# EAGLE schematic dlp.vco.dualosc.v1.1 (EAGLE 7.2.0)
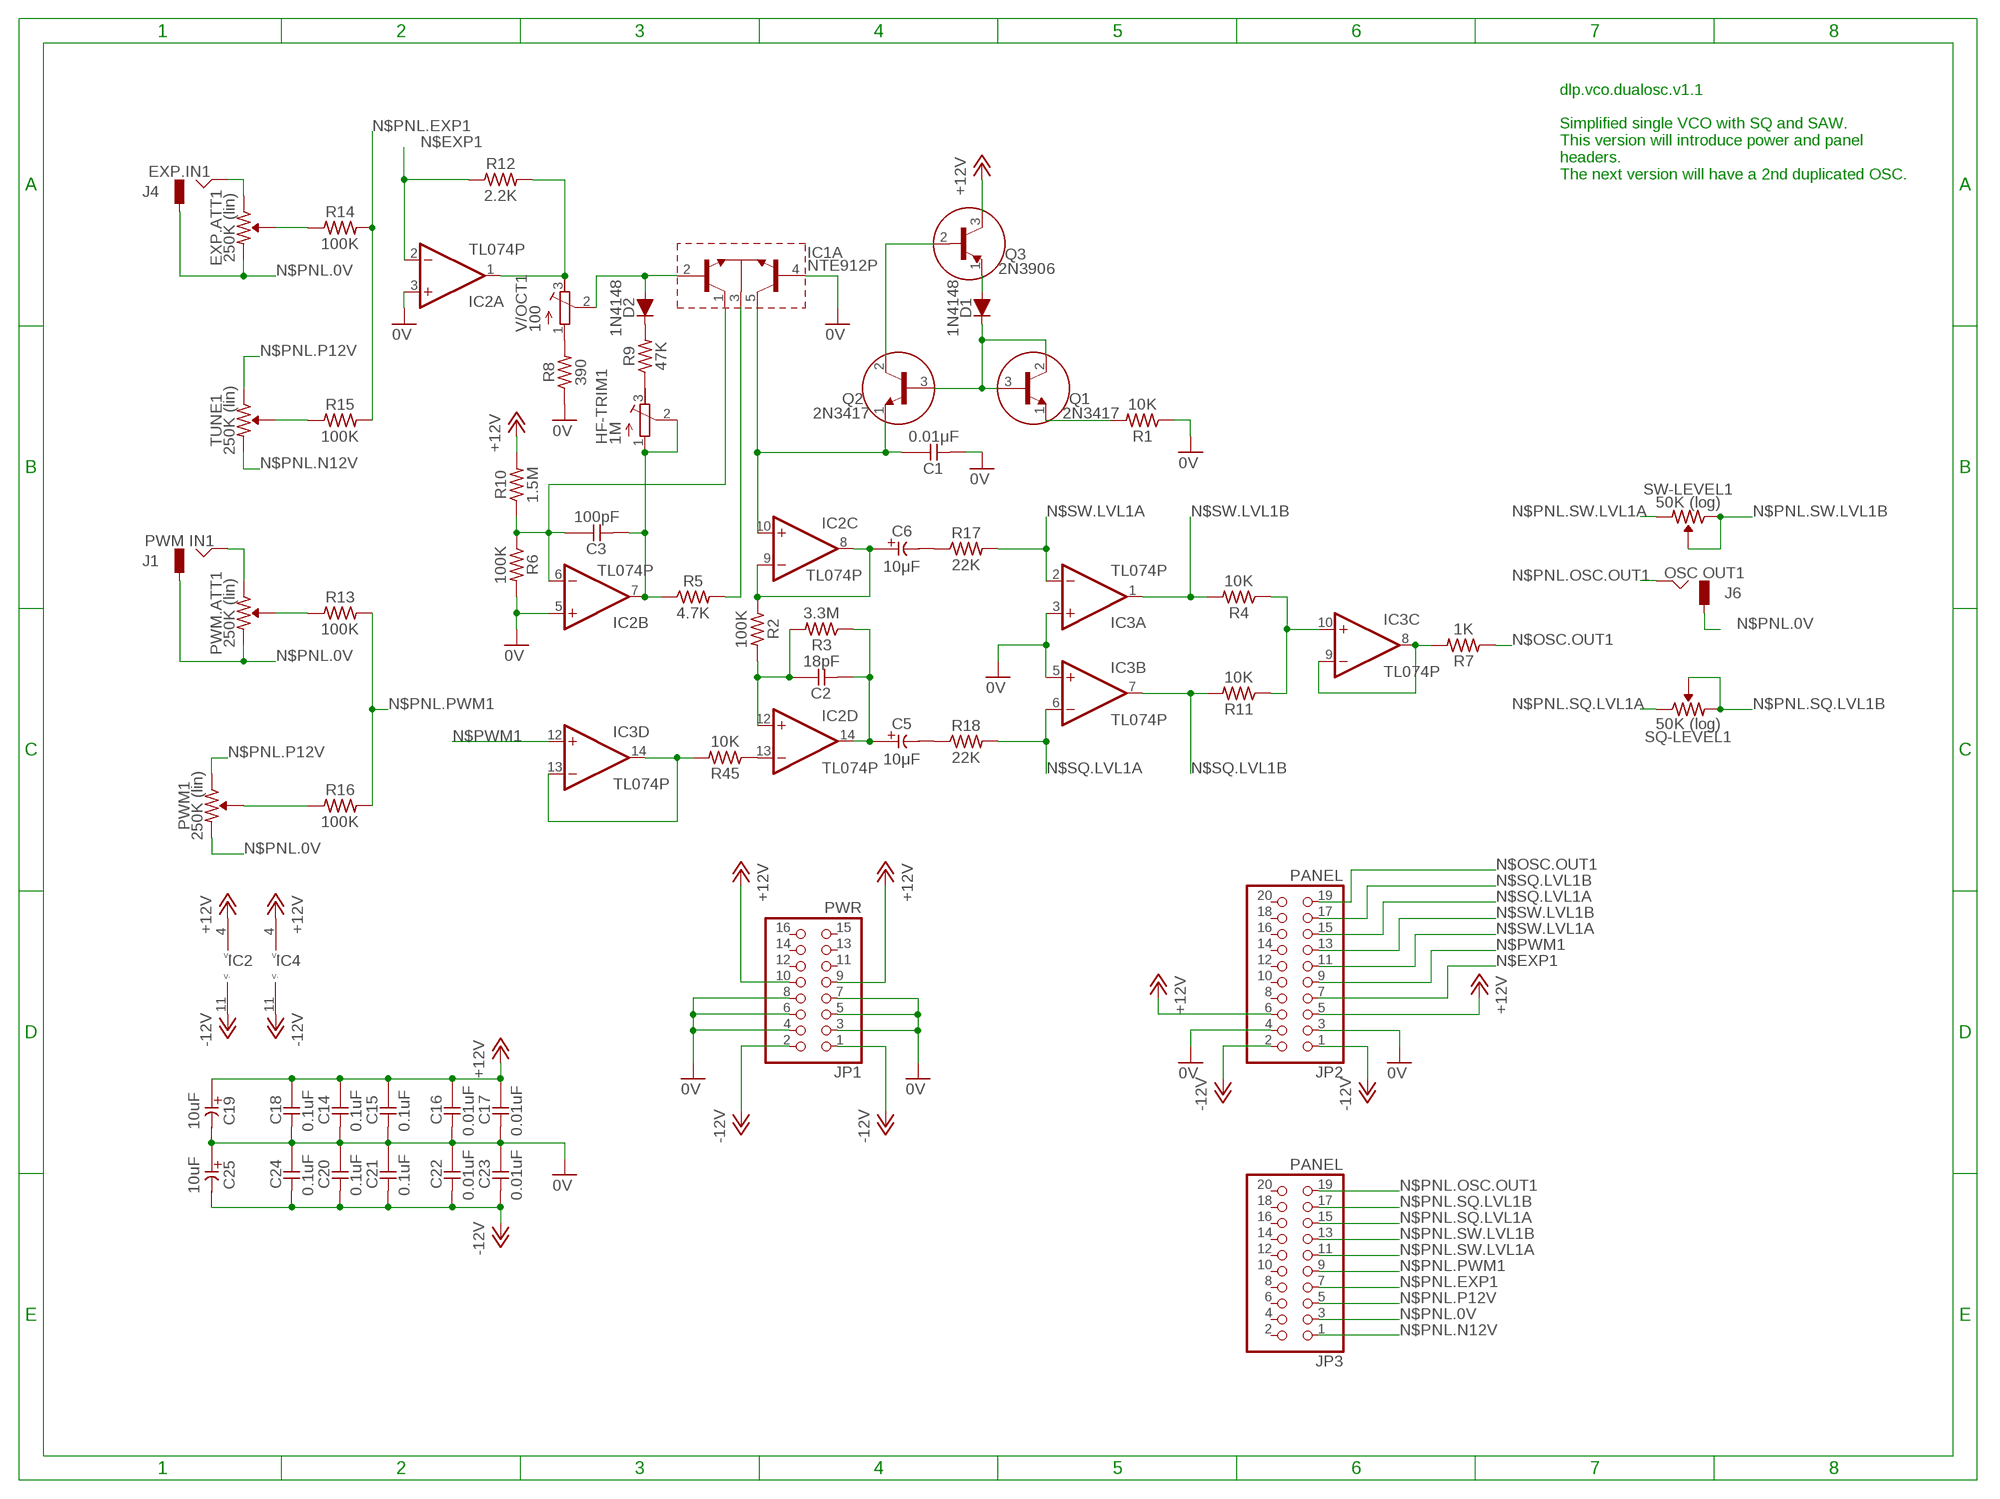
[diagram p0: schematic, sheet 1]

## Parts
C1  0.01μF  CC-US025-024X044  [C025-024X044]
C2  18pF  CC-US025-024X044  [C025-024X044]
C3  100pF  CC-US025-024X044  [C025-024X044]
C5  10μF  CE-USE2-5  [E2-5]
C6  10μF  CE-USE2-5  [E2-5]
C14  0.1uF  CC-US025-024X044  [C025-024X044]
C15  0.1uF  CC-US025-024X044  [C025-024X044]
C16  0.01uF  CC-US025-024X044  [C025-024X044]
C17  0.01uF  CC-US025-024X044  [C025-024X044]
C18  0.1uF  CC-US025-024X044  [C025-024X044]
C19  10uF  CE-USE2-5  [E2-5]
C20  0.1uF  CC-US025-024X044  [C025-024X044]
C21  0.1uF  CC-US025-024X044  [C025-024X044]
C22  0.01uF  CC-US025-024X044  [C025-024X044]
C23  0.01uF  CC-US025-024X044  [C025-024X044]
C24  0.1uF  CC-US025-024X044  [C025-024X044]
C25  10uF  CE-USE2-5  [E2-5]
D1  1N4148  [DO35-7]
D2  1N4148  [DO35-7]
EXP.ATT1  250K (lin)  R-VAR  [R-VAR]
HF-TRIM1  1M  R-TRIMM3296Y  [RTRIM3296Y]
IC1  NTE912P  [DIL14]
IC2  TL074P  [DIL14]
IC3  TL074P  [DIL14]
J1  PWM IN1  JACK-M  [JACK-M]
J4  EXP.IN1  JACK-M  [JACK-M]
J6  OSC OUT1  JACK-M  [JACK-M]
JP1  PWR  PINHD-2X8  [2X08]
JP2  PANEL  PINHD-2X10  [2X10]
JP3  PANEL  PINHD-2X10  [2X10]
PWM1  250K (lin)  R-VAR  [R-VAR]
PWM.ATT1  250K (lin)  R-VAR  [R-VAR]
Q1  2N3417  [TO92]
Q2  2N3417  [TO92]
Q3  2N3906  [TO92]
R1  10K  R0309/10  [0309/10]
R2  100K  R0309/10  [0309/10]
R3  3.3M  R0309/10  [0309/10]
R4  10K  R0309/10  [0309/10]
R5  4.7K  R0309/10  [0309/10]
R6  100K  R0309/10  [0309/10]
R7  1K  R0309/10  [0309/10]
R8  390  R0309/10  [0309/10]
R9  47K  R0309/10  [0309/10]
R10  1.5M  R0309/10  [0309/10]
R11  10K  R0309/10  [0309/10]
R12  2.2K  R0309/10  [0309/10]
R13  100K  R0309/10  [0309/10]
R14  100K  R0309/10  [0309/10]
R15  100K  R0309/10  [0309/10]
R16  100K  R0309/10  [0309/10]
R17  22K  R0309/10  [0309/10]
R18  22K  R0309/10  [0309/10]
R45  10K  R0309/10  [0309/10]
SQ-LEVEL1  50K (log)  R-VAR  [R-VAR]
SW-LEVEL1  50K (log)  R-VAR  [R-VAR]
TUNE1  250K (lin)  R-VAR  [R-VAR]
V/OCT1  100  R-TRIMM3296Y  [RTRIM3296Y]

## Nets
0V: C1.2 C14.2 C15.2 C16.2 C17.2 C18.2 C19.- C20.1 C21.1 C22.1 C23.1 C24.1 C25.+ IC1.4(A:B3) IC2.3(A:+IN) IC2.5(B:+IN) IC3.3(A:+IN) IC3.5(B:+IN) JP1.3 JP1.4 JP1.5 JP1.6 JP1.7 JP1.8 JP2.3 JP2.4 R1.1 R6.2 R8.1
+12V: C14.1 C15.1 C16.1 C17.1 C18.1 C19.+ IC2.4(P:V+) IC3.4(P:V+) JP1.9 JP1.10 JP2.5 JP2.6 Q3.3(C) R10.2
-12V: C20.2 C21.2 C22.2 C23.2 C24.2 C25.- IC2.11(P:V-) IC3.11(P:V-) JP1.1 JP1.2 JP2.1 JP2.2
N$1: C1.1 IC1.5(A:C3) IC2.10(C:+IN) Q2.1(E)
N$2: Q2.2(C) Q3.2(B)
N$3: D1.A Q3.1(E)
N$4: C6.+ IC2.8(C:OUT) IC2.9(C:-IN) R2.1
N$5: D1.C Q1.2(C) Q1.3(B) Q2.3(B)
N$6: Q1.1(E) R1.2
N$7: C2.1 IC2.12(D:+IN) R2.2 R3.2
N$8: IC2.13(D:-IN) R45.1
N$9: C2.2 C5.+ IC2.14(D:OUT) R3.1
N$10: PWM.ATT1.VAR R13.1
N$11: D2.A IC1.2(A:B1) V/OCT1.2(S)
N$12: IC1.3(A:E) R5.2
N$13: D2.C R9.2
N$14: R8.2 V/OCT1.1(A)
N$15: C3.1 IC1.1(A:C1) IC2.6(B:-IN) R6.1 R10.1
N$16: IC2.1(A:OUT) R12.2 V/OCT1.3(E)
N$17: HF-TRIM1.3(E) R9.1
N$18: IC3.10(C:+IN) R4.1 R11.1
N$19: PWM1.VAR R16.1
N$20: IC3.8(C:OUT) IC3.9(C:-IN) R7.2
N$23: EXP.ATT1.VAR R14.1
N$24: R15.1 TUNE1.VAR
N$25: J1.HOT PWM.ATT1.R1
N$26: EXP.ATT1.R1 J4.HOT
N$27: IC3.13(D:-IN) IC3.14(D:OUT) R45.2
N$29: C6.- R17.1
N$30: C5.- R18.1
N$37: C3.2 HF-TRIM1.1(A) HF-TRIM1.2(S) IC2.7(B:OUT) R5.1
N$EXP1: IC2.2(A:-IN) JP2.7 R12.1
N$OSC.OUT1: JP2.19 R7.1
N$PNL.0V: EXP.ATT1.R2 J1.GND J4.GND J6.GND JP3.3 PWM1.R2 PWM.ATT1.R2
N$PNL.EXP1: JP3.7 R14.2 R15.2
N$PNL.N12V: JP3.1 TUNE1.R2
N$PNL.OSC.OUT1: J6.HOT JP3.19
N$PNL.P12V: JP3.5 PWM1.R1 TUNE1.R1
N$PNL.PWM1: JP3.9 R13.2 R16.2
N$PNL.SQ.LVL1A: JP3.15 SQ-LEVEL1.R1
N$PNL.SQ.LVL1B: JP3.17 SQ-LEVEL1.R2 SQ-LEVEL1.VAR
N$PNL.SW.LVL1A: JP3.11 SW-LEVEL1.R2
N$PNL.SW.LVL1B: JP3.13 SW-LEVEL1.R1 SW-LEVEL1.VAR
N$PWM1: IC3.12(D:+IN) JP2.9
N$SQ.LVL1A: IC3.6(B:-IN) JP2.15 R18.2
N$SQ.LVL1B: IC3.7(B:OUT) JP2.17 R11.2
N$SW.LVL1A: IC3.2(A:-IN) JP2.11 R17.2
N$SW.LVL1B: IC3.1(A:OUT) JP2.13 R4.2
Unconnected: IC1.6(B:B) IC1.7(B:E) IC1.8(B:C) IC1.9(C:B) IC1.10(C:E) IC1.11(C:C) IC1.12(D:B) IC1.13(D:E) IC1.14(D:C) JP1.11 JP1.12 JP1.13 JP1.14 JP1.15 JP1.16 JP2.8 JP2.10 JP2.12 JP2.14 JP2.16 JP2.18 JP2.20 JP3.2 JP3.4 JP3.6 JP3.8 JP3.10 JP3.12 JP3.14 JP3.16 JP3.18 JP3.20

## Notes on the sheet
- dlp.vco.dualosc.v1.1
  
  Simplified single VCO with SQ and SAW.
  This version will introduce power and panel 
  headers.
  The next version will have a 2nd duplicated OSC.
- IC2 | IC4

## Library data of the parts
C1-C3 C14-C18 C20-C24 = _common:CC-US: CAPACITOR, US symbol
C5 C6 C19 C25 = _common:CE-US: ELECTROLYTIC CAPACITOR, US symbol
D1 D2 = _common:1N4148: DIODE high speed (Philips)
EXP.ATT1 PWM1 PWM.ATT1 SQ-LEVEL1 SW-LEVEL1 TUNE1 = _common:R-VAR
HF-TRIM1 V/OCT1 = rcl:R-TRIMM: Trimm resistor
IC1 = _common:NTE912: NPN TRANSISTOR ARRAY
IC2 IC3 = _common:TL074: OP AMP
J1 J4 J6 = _common:JACK-M
JP1 = pinhead:PINHD-2X8: PIN HEADER
JP2 JP3 = pinhead:PINHD-2X10: PIN HEADER
Q1 Q2 = _common:2N3417: NPN Transistor
Q3 = _common:2N3906: PNP Transistor
R1-R18 R45 = _common:R: RESISTOR, US symbol